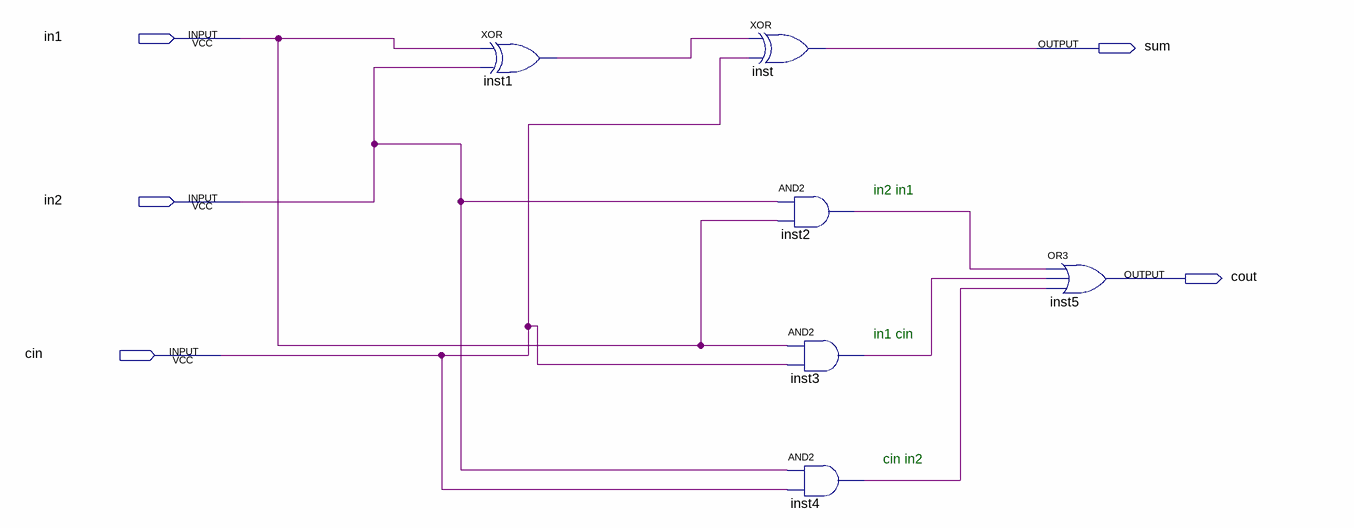
[diagram p0: schematic sheet]
// Quartus schematic FullAdder.bdf as structural Verilog: 6 symbols, 5 pins
module FullAdder (
  input  in1,
  input  in2,
  input  cin,
  output sum,
  output cout
);

  wire inst1_out, inst2_out, inst3_out, inst4_out;

  xor inst1 (inst1_out, in1, in2);
  xor inst (sum, inst1_out, cin);
  and inst2 (inst2_out, in2, in1);
  and inst3 (inst3_out, in1, cin);
  and inst4 (inst4_out, in2, cin);
  or inst5 (cout, inst2_out, inst3_out, inst4_out);

  // Notes on the sheet:
  //   in2 in1
  //   in1 cin
  //   cin in2
endmodule
